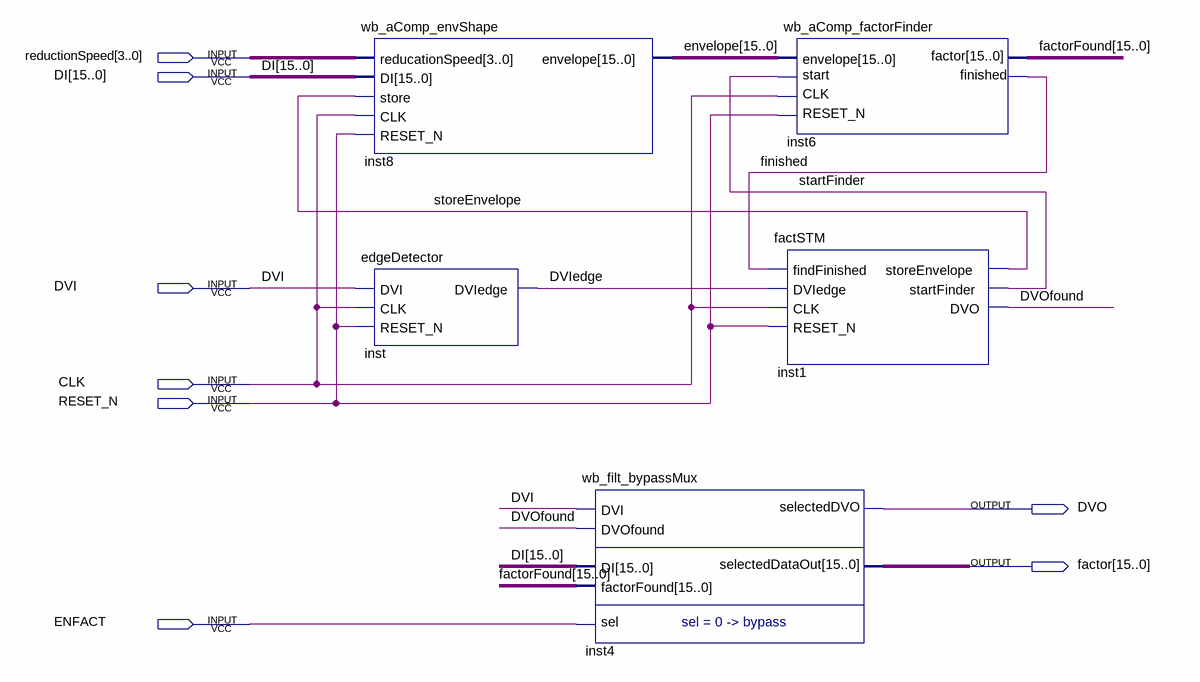
[diagram p0: schematic sheet]
// Quartus schematic fact.bdf as structural Verilog: 5 symbols, 8 pins
module fact (
  input  [3:0] reductionSpeed,
  input  [15:0] DI,
  input  DVI,
  input  CLK,
  input  RESET_N,
  input  ENFACT,
  output DVO,
  output [15:0] factor
);

  wire DVIedge, DVOfound, finished, startFinder, storeEnvelope;
  wire [15:0] envelope, factorFound;

  wb_aComp_envShape inst8 (
    .reducationSpeed(reductionSpeed), .DI(DI), .CLK(CLK), .store(storeEnvelope), .RESET_N(RESET_N),
    .envelope(envelope));
  edgeDetector inst (.DVI(DVI), .CLK(CLK), .RESET_N(RESET_N), .DVIedge(DVIedge));
  wb_filt_bypassMux inst4 (
    .sel(ENFACT), .DVI(DVI), .DVOfound(DVOfound), .factorFound(factorFound), .DI(DI), .selectedDVO(DVO),
    .selectedDataOut(factor));
  wb_aComp_factorFinder inst6 (
    .RESET_N(RESET_N), .CLK(CLK), .start(startFinder), .envelope(envelope), .factor(factorFound),
    .finished(finished));
  factSTM inst1 (
    .findFinished(finished), .DVIedge(DVIedge), .CLK(CLK), .RESET_N(RESET_N), .storeEnvelope(storeEnvelope),
    .startFinder(startFinder), .DVO(DVOfound));
endmodule
